# Altium schematic sheet Stack_A.SchDoc
size A3 portrait
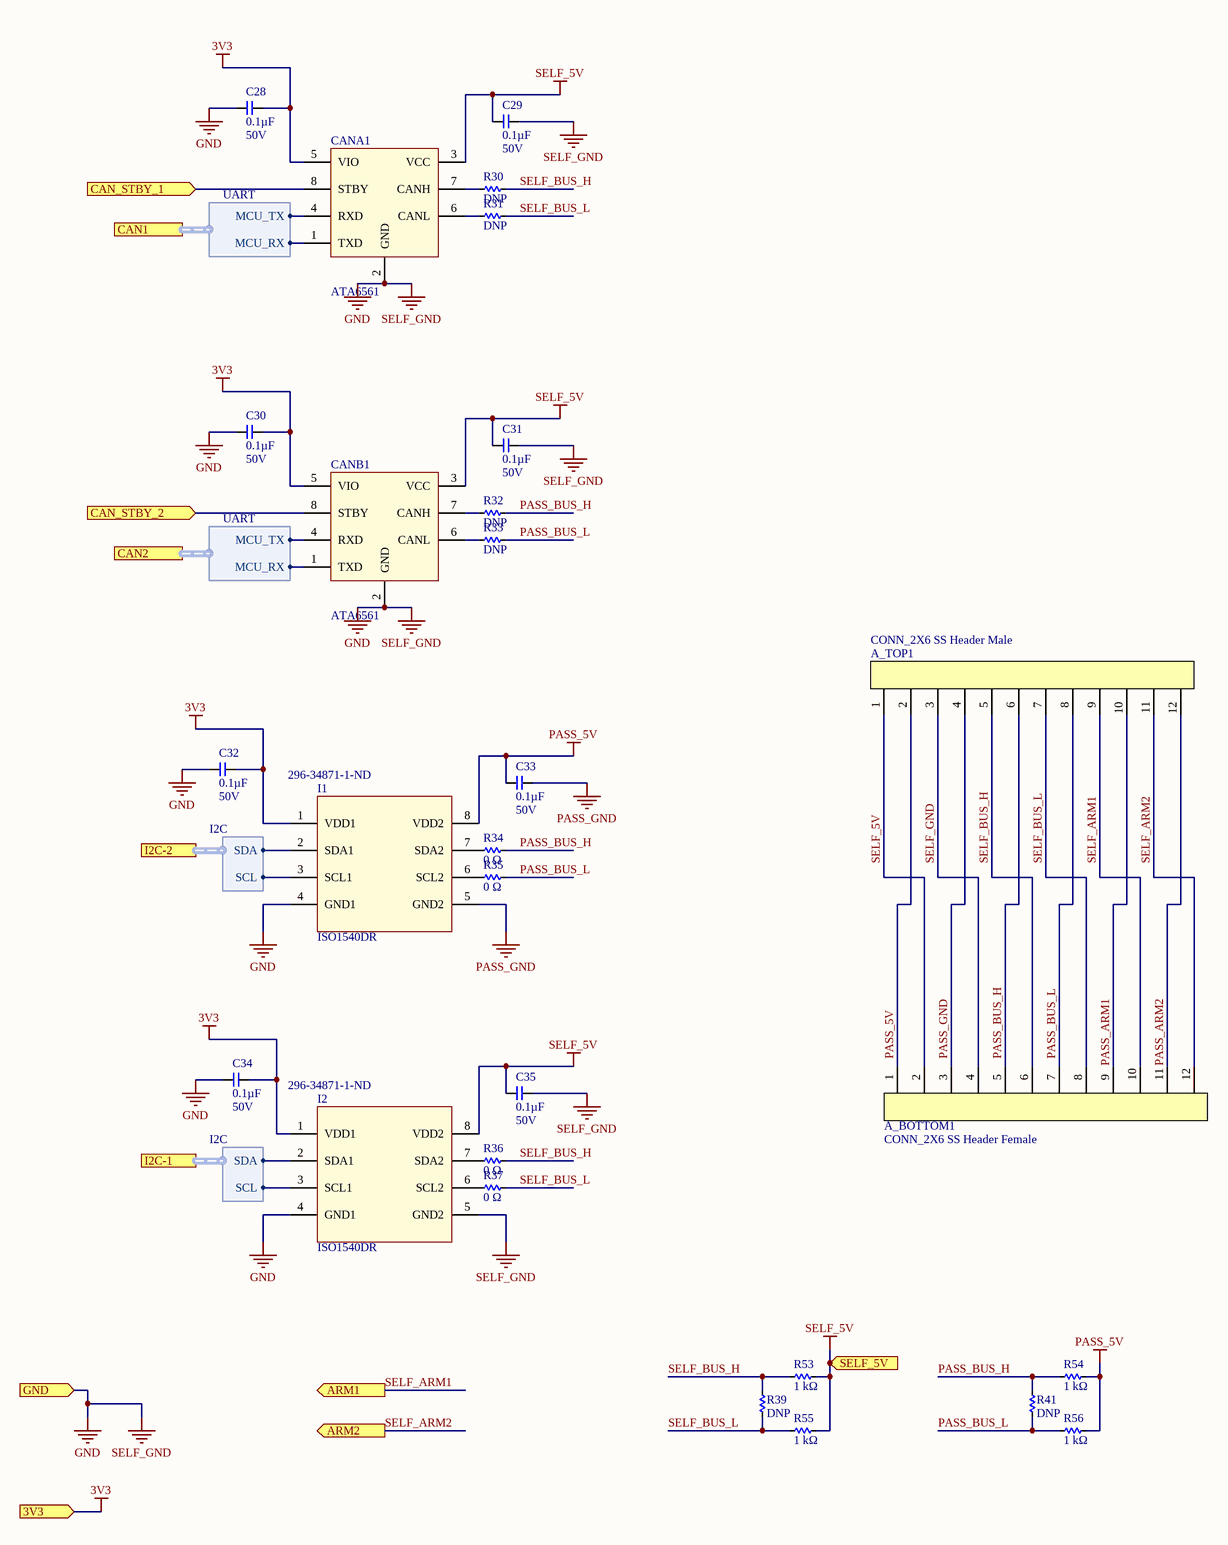
[diagram p0: Stack_A.SchDoc]

## Parts
A_BOTTOM1  CONN_2X6 SS Header Female  [SAMTEC_SSW-106-22-F-D-VS]
A_TOP1  CONN_2X6 SS Header Male  [SAMTEC_TSM-106-03-F-DV]
C28  Capacitance (shorthand): 0.1µF  Rated Voltage: 50V  [C0603]  (hidden comment: __template_cap)
C29  Capacitance (shorthand): 0.1µF  Rated Voltage: 50V  [C0603]  (hidden comment: __template_cap)
C30  Capacitance (shorthand): 0.1µF  Rated Voltage: 50V  [C0603]  (hidden comment: __template_cap)
C31  Capacitance (shorthand): 0.1µF  Rated Voltage: 50V  [C0603]  (hidden comment: __template_cap)
C32  Capacitance (shorthand): 0.1µF  Rated Voltage: 50V  [C0603]  (hidden comment: __template_cap)
C33  Capacitance (shorthand): 0.1µF  Rated Voltage: 50V  [C0603]  (hidden comment: __template_cap)
C34  Capacitance (shorthand): 0.1µF  Rated Voltage: 50V  [C0603]  (hidden comment: __template_cap)
C35  Capacitance (shorthand): 0.1µF  Rated Voltage: 50V  [C0603]  (hidden comment: __template_cap)
CANA1  ATA6561  [8SOIC150]
CANB1  ATA6561  [8SOIC150]
I1  Manufacturer Part Number: ISO1540DR  Supplier Part Number 1: 296-34871-1-ND  [8SOIC150]  (hidden comment: ISO_Si8401AB-B-IS)
I2  Manufacturer Part Number: ISO1540DR  Supplier Part Number 1: 296-34871-1-ND  [8SOIC150]  (hidden comment: ISO_Si8401AB-B-IS)
R30  Resistance: DNP  [R0603]  (hidden comment: __template_resistor)
R31  Resistance: DNP  [R0603]  (hidden comment: __template_resistor)
R32  Resistance: DNP  [R0603]  (hidden comment: __template_resistor)
R33  Resistance: DNP  [R0603]  (hidden comment: __template_resistor)
R34  Resistance: 0 Ω  [R0603]  (hidden comment: __template_resistor)
R35  Resistance: 0 Ω  [R0603]  (hidden comment: __template_resistor)
R36  Resistance: 0 Ω  [R0603]  (hidden comment: __template_resistor)
R37  Resistance: 0 Ω  [R0603]  (hidden comment: __template_resistor)
R39  Resistance: DNP  [R0603]  (hidden comment: __template_resistor)
R41  Resistance: DNP  [R0603]  (hidden comment: __template_resistor)
R53  Resistance: 1 kΩ  [R0603]  (hidden comment: __template_resistor)
R54  Resistance: 1 kΩ  [R0603]  (hidden comment: __template_resistor)
R55  Resistance: 1 kΩ  [R0603]  (hidden comment: __template_resistor)
R56  Resistance: 1 kΩ  [R0603]  (hidden comment: __template_resistor)

## Ports
3V3 (in), ARM1 (out), ARM2 (out), CAN1 (harness UART), CAN2 (harness UART), CAN_STBY_1 (in), CAN_STBY_2 (in), GND (in), I2C-1 (harness I2C), I2C-2 (harness I2C), SELF_5V (in)

## Harnesses
UART: MCU_RX, MCU_TX
I2C: SDA, SCL

## Nets
3V3: C28.2 C30.2 C32.2 C34.2 CANA1.5(VIO) CANB1.5(VIO) I1.1(VDD1) I2.1(VDD1) ; port 3V3
PASS_5V: A_BOTTOM1.1 A_TOP1.2 C33.2 I1.8(VDD2) R54.2 R56.2
PASS_GND: A_BOTTOM1.3 A_TOP1.4 C33.1 I1.5(GND2)
SELF_5V: A_BOTTOM1.2 A_TOP1.1 C29.2 C31.2 C35.2 CANA1.3(VCC) CANB1.3(VCC) I2.8(VDD2) R53.2 R55.2 ; port SELF_5V
SELF_GND: A_BOTTOM1.4 A_TOP1.3 C28.1 C29.1 C30.1 C31.1 C32.1 C34.1 C35.1 CANA1.2(GND) CANB1.2(GND) I1.4(GND1) I2.4(GND1) I2.5(GND2) ; port GND  [also labelled GND]
CAN_STBY_1: CANA1.8(STBY) ; port CAN_STBY_1
CAN_STBY_2: CANB1.8(STBY) ; port CAN_STBY_2
PASS_ARM1: A_BOTTOM1.9 A_TOP1.10
PASS_ARM2: A_BOTTOM1.11 A_TOP1.12
PASS_BUS_H: A_BOTTOM1.5 A_TOP1.6 R32.2 R34.2 R41.2 R54.1
PASS_BUS_L: A_BOTTOM1.7 A_TOP1.8 R33.2 R35.2 R41.1 R56.1
SELF_ARM1: A_BOTTOM1.10 A_TOP1.9 ; port ARM1
SELF_ARM2: A_BOTTOM1.12 A_TOP1.11 ; port ARM2
SELF_BUS_H: A_BOTTOM1.6 A_TOP1.5 R30.2 R36.2 R39.2 R53.1
SELF_BUS_L: A_BOTTOM1.8 A_TOP1.7 R31.2 R37.2 R39.1 R55.1
NetCANA1_1: CANA1.1(TXD) ; port CAN1.MCU_RX
NetCANA1_4: CANA1.4(RXD) ; port CAN1.MCU_TX
NetCANA1_6: CANA1.6(CANL) R31.1
NetCANA1_7: CANA1.7(CANH) R30.1
NetCANB1_1: CANB1.1(TXD) ; port CAN2.MCU_RX
NetCANB1_4: CANB1.4(RXD) ; port CAN2.MCU_TX
NetCANB1_6: CANB1.6(CANL) R33.1
NetCANB1_7: CANB1.7(CANH) R32.1
NetI1_2: I1.2(SDA1) ; port I2C-2.SDA
NetI1_3: I1.3(SCL1) ; port I2C-2.SCL
NetI1_6: I1.6(SCL2) R35.1
NetI1_7: I1.7(SDA2) R34.1
NetI2_2: I2.2(SDA1) ; port I2C-1.SDA
NetI2_3: I2.3(SCL1) ; port I2C-1.SCL
NetI2_6: I2.6(SCL2) R37.1
NetI2_7: I2.7(SDA2) R36.1

## Notes on the sheet
- Title
- Size:
- Date:
- A3
- Number:
- Time:
- Revision:
- Sheet
- of
- File:

## Library data of the parts
A_BOTTOM1 A_TOP1 = CONN_2X6 SS Header
C28-C35 = CAP CER 0603 0.1µF X7R 50V 10%: Manufacturer: Murata Electronics North America; Capacitance - pF (Machine readable): 100000; type: capacitor; Dielectric: X7R; Supplier 1: Digikey; Supplier Part Number 1: 490-1519-1-ND
CANA1 CANB1 = ATA6561: Atmel CAN Bus Transciever; Supplier 1: Digi-Key; Supplier Part Number 1: ATA6561-GAQW-NCT-ND
I1 I2 = ISO_Si8401AB-B-IS: Isolator Interface IC 2.5 kV Bidirectional I2C Isolator 1.7MHz; Manufacturer: Texas Instruments; Supply Current: 3.9 mA; Number of Channels: 2; Power Dissipation: 220 W; Supply Voltage (Max): 5.5 V; Supply Voltage (Min): 3 V; Propagation Delay Time: 20 ns; Product Status: New Technology; RoHS: RoHS Compliant; Category: Isolator Interface IC; Package / Case: SOIC-8 Narrow; Packaging: Tube; Mounting Style: SMD/SMT; Maximum Operating Temperature: + 125 C; Minimum Operating Temperature: - 40 C; Product Category: Power - Digital Isoloators; RoHS - Mouser: Y; Minimum Order Quantity: 1; Reeling: False; ComponentLink1URL: http://www.silabs.com/Support%20Documents/TechnicalDocs/Si840x.pdf; ComponentLink1Description: Datasheet; Supplier 1: Digi-Key
R30-R33 R39 R41 = RES SMD DNP 0603: Resistance (Sortable): DNP
R34-R37 = RES SMD 0 OHM JUMPER 1/10W 0603: Manufacturer Part Number: RC0603FR-070RL; Manufacturer: Yageo; Resistance (Sortable): 0; Tolerance: Jumper; Power (Watts): 0.1W, 1/10W; Supplier 1: Digikey; Datasheets: http://www.yageo.com/documents/recent/PYu-RC_Group_51_RoHS_L_9.pdf; Image: //media.digikey.com/Renders/Yageo%20Renders/0603-(1608-Metric).jpg; Supplier Part Number 1: 311-0.0HRCT-ND; Temperature Coefficient: -; Operating Temperature: -55°C ~ 155°C
R53-R56 = RES SMD 1K OHM 1% 1/10W 0603: Manufacturer Part Number: RC0603FR-071KL; Manufacturer: Yageo; Resistance (Sortable): 1000; Tolerance: ±1%; Power (Watts): 0.1W, 1/10W; Temperature Coefficient: ±100ppm/°C; Supplier 1: Digikey; Datasheets: http://www.yageo.com/documents/recent/PYu-RC_Group_51_RoHS_L_9.pdf; Image: //media.digikey.com/Renders/Yageo%20Renders/0603-(1608-Metric).jpg; Supplier Part Number 1: 311-1.00KHRCT-ND; Operating Temperature: -55°C ~ 155°C